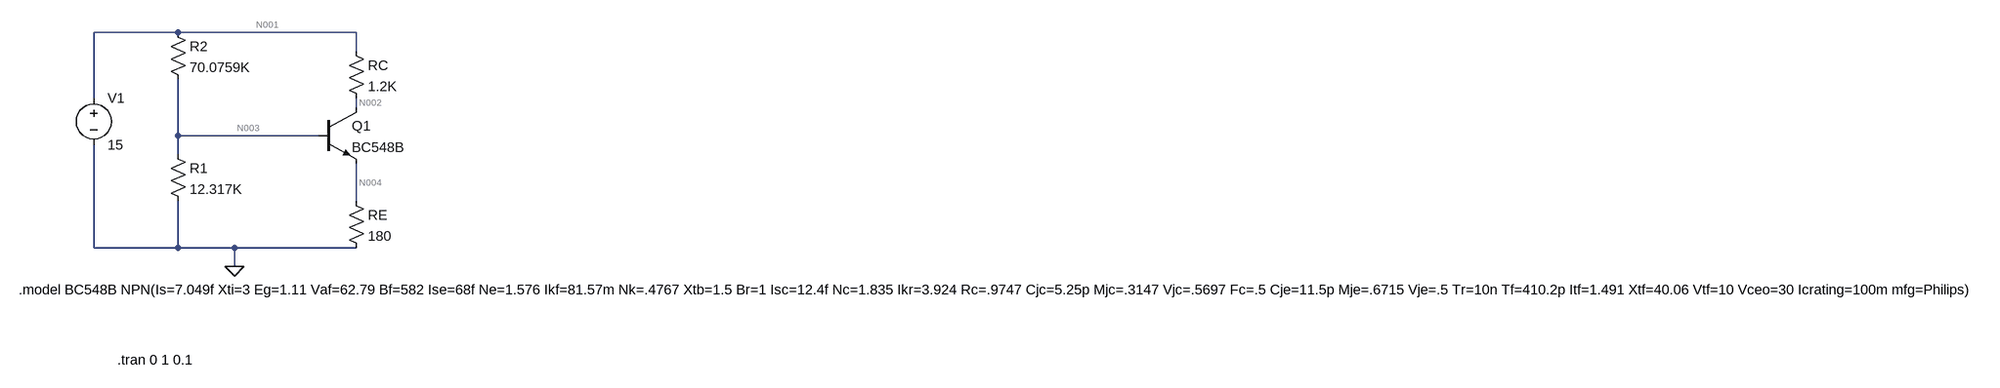
[diagram p0: schematic Sim_Ideal.asc]
Sim_Ideal.asc, the LTspice schematic file:
Version 4.1
SHEET 1 3980 680
WIRE -48 -32 -192 -32
WIRE 256 -32 -48 -32
WIRE 256 0 256 -32
WIRE -192 80 -192 -32
WIRE 256 96 256 80
WIRE -48 144 -48 48
WIRE 192 144 -48 144
WIRE -48 176 -48 144
WIRE 256 256 256 192
WIRE -192 336 -192 160
WIRE -48 336 -48 256
WIRE -48 336 -192 336
WIRE 48 336 -48 336
WIRE 256 336 48 336
WIRE 48 368 48 336
FLAG 48 368 0
SYMBOL npn 192 96 R0
SYMATTR InstName Q1
SYMATTR Value BC548B
SYMBOL res -64 -48 R0
SYMATTR InstName R2
SYMATTR Value 70.0759K
SYMBOL res 240 -16 R0
SYMATTR InstName RC
SYMATTR Value 1.2K
SYMBOL res 240 240 R0
SYMATTR InstName RE
SYMATTR Value 180
SYMBOL res -64 160 R0
SYMATTR InstName R1
SYMATTR Value 12.317K
SYMBOL voltage -192 64 R0
SYMATTR InstName V1
SYMATTR Value 15
TEXT -320 408 Left 2 !.model BC548B NPN(Is=7.049f Xti=3 Eg=1.11 Vaf=62.79 Bf=582 Ise=68f Ne=1.576 Ikf=81.57m Nk=.4767 Xtb=1.5 Br=1 Isc=12.4f Nc=1.835 Ikr=3.924 Rc=.9747 Cjc=5.25p Mjc=.3147 Vjc=.5697 Fc=.5 Cje=11.5p Mje=.6715 Vje=.5 Tr=10n Tf=410.2p Itf=1.491 Xtf=40.06 Vtf=10 Vceo=30 Icrating=100m mfg=Philips)
TEXT -152 528 Left 2 !.tran 0 1 0.1

The netlist it stands for:
* Sim_Ideal.asc
Q1 N002 N003 N004 0 BC548B
R2 N001 N003 70.0759K
RC N001 N002 1.2K
RE N004 0 180
R1 N003 0 12.317K
V1 N001 0 15
.model NPN NPN
.model PNP PNP
.lib standard.bjt
.model BC548B NPN(Is=7.049f Xti=3 Eg=1.11 Vaf=62.79 Bf=582 Ise=68f Ne=1.576 Ikf=81.57m Nk=.4767 Xtb=1.5 Br=1 Isc=12.4f Nc=1.835 Ikr=3.924 Rc=.9747 Cjc=5.25p Mjc=.3147 Vjc=.5697 Fc=.5 Cje=11.5p Mje=.6715 Vje=.5 Tr=10n Tf=410.2p Itf=1.491 Xtf=40.06 Vtf=10 Vceo=30 Icrating=100m mfg=Philips)
.tran 0 1 0.1
.backanno
.end

* Results of the author's LTspice run, read from the files saved beside the schematic
* Operating Point, zero values left out:
*   V(n003) = 2.074 V
*   V(n001) = 15 V
*   V(n002) = 5.975 V
*   V(n004) = 1.357 V
*   Ic(Q1) = 7.521 mA
*   Ib(Q1) = 16.12 µA
*   Ie(Q1) = -7.537 mA
*   I(V1) = -7.706 mA
*   I(RC) = 7.521 mA
*   I(R1) = 168.3 µA
*   I(R2) = 184.5 µA
*   I(RE) = 7.537 mA